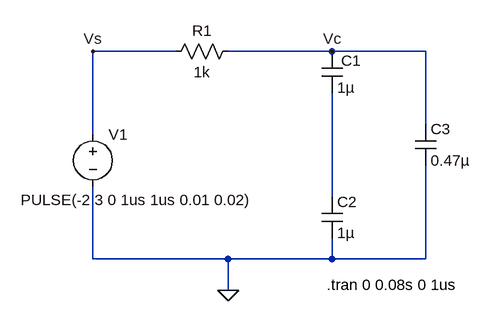
[diagram p0: schematic Draft1.asc]
Draft1.asc, the LTspice schematic file:
Version 4
SHEET 1 880 680
WIRE 96 0 -32 0
WIRE 336 0 176 0
WIRE 480 0 336 0
WIRE 480 112 480 0
WIRE -32 128 -32 0
WIRE 336 224 336 64
WIRE -32 320 -32 208
WIRE 176 320 -32 320
WIRE 336 320 336 288
WIRE 336 320 176 320
WIRE 480 320 480 176
WIRE 480 320 336 320
WIRE 176 368 176 320
FLAG 176 368 0
FLAG -32 0 Vs
FLAG 336 0 Vc
SYMBOL voltage -32 112 R0
WINDOW 3 -111 117 Left 2
WINDOW 123 0 0 Left 0
WINDOW 39 0 0 Left 0
SYMATTR InstName V1
SYMATTR Value PULSE(-2 3 0 1us 1us 0.01 0.02)
SYMBOL res 192 -16 R90
WINDOW 0 0 56 VBottom 2
WINDOW 3 32 56 VTop 2
SYMATTR InstName R1
SYMATTR Value 1k
SYMBOL cap 320 0 R0
WINDOW 0 30 14 Left 2
SYMATTR InstName C1
SYMATTR Value 1µ
SYMBOL cap 320 224 R0
SYMATTR InstName C2
SYMATTR Value 1µ
SYMBOL cap 464 112 R0
SYMATTR InstName C3
SYMATTR Value 0.47µ
TEXT 328 360 Left 2 !.tran 0 0.08s 0 1us

The netlist it stands for:
* Draft1.asc
V1 Vs 0 PULSE(-2 3 0 1us 1us 0.01 0.02)
R1 Vc Vs 1k
C1 Vc N001 1µ
C2 N001 0 1µ
C3 Vc 0 0.47µ
.tran 0 0.08s 0 1us
.backanno
.end